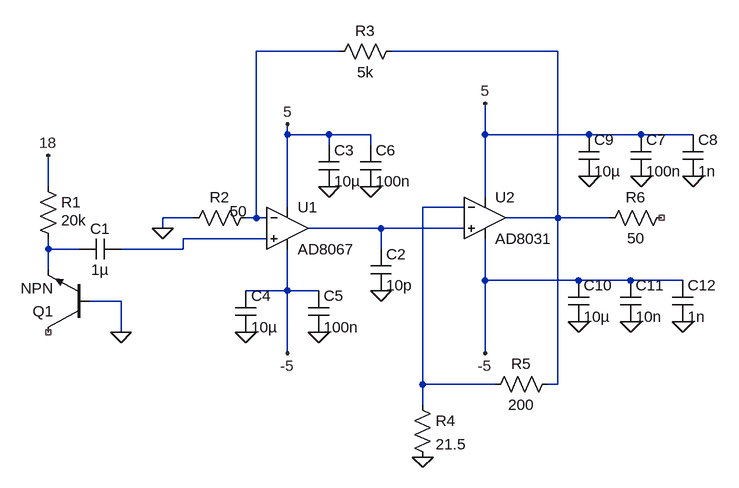
[diagram p0: schematic AD8067Test.asc]
AD8067Test.asc, the LTspice schematic file:
Version 4
SHEET 1 1224 680
WIRE 624 -176 496 -176
WIRE 960 -176 704 -176
WIRE 544 -48 544 -64
WIRE 608 -48 544 -48
WIRE 672 -48 608 -48
WIRE 848 -48 848 -96
WIRE 1008 -48 848 -48
WIRE 1088 -48 1008 -48
WIRE 1168 -48 1088 -48
WIRE 608 -32 608 -48
WIRE 672 -32 672 -48
WIRE 176 32 176 -16
WIRE 848 48 848 -48
WIRE 544 64 544 -48
WIRE 816 64 752 64
WIRE 400 80 352 80
WIRE 496 80 496 -176
WIRE 496 80 480 80
WIRE 512 80 496 80
WIRE 960 80 960 -176
WIRE 960 80 880 80
WIRE 1040 80 960 80
WIRE 352 96 352 80
WIRE 688 96 576 96
WIRE 816 96 688 96
WIRE 512 112 384 112
WIRE 176 128 176 112
WIRE 224 128 176 128
WIRE 384 128 384 112
WIRE 384 128 288 128
WIRE 688 128 688 96
WIRE 176 160 176 128
WIRE 848 176 848 112
WIRE 992 176 848 176
WIRE 1072 176 992 176
WIRE 1152 176 1072 176
WIRE 544 192 544 128
WIRE 544 192 480 192
WIRE 592 192 544 192
WIRE 288 208 240 208
WIRE 288 256 288 208
WIRE 544 288 544 192
WIRE 848 288 848 176
WIRE 752 336 752 64
WIRE 864 336 752 336
WIRE 960 336 960 80
WIRE 960 336 944 336
WIRE 752 368 752 336
FLAG 288 256 0
FLAG 176 -16 18
FLAG 544 -64 5
FLAG 848 -96 5
FLAG 544 288 -5
FLAG 848 288 -5
FLAG 352 96 0
FLAG 752 448 0
FLAG 688 192 0
FLAG 608 32 0
FLAG 672 32 0
FLAG 592 256 0
FLAG 480 256 0
FLAG 1008 16 0
FLAG 1088 16 0
FLAG 1168 16 0
FLAG 1152 240 0
FLAG 1072 240 0
FLAG 992 240 0
SYMBOL npn 240 256 R180
SYMATTR InstName Q1
SYMBOL res 160 16 R0
WINDOW 3 36 68 Left 2
SYMATTR InstName R1
SYMATTR Value 20k
SYMBOL cap 288 112 R90
WINDOW 0 0 32 VBottom 2
WINDOW 3 32 32 VTop 2
SYMATTR InstName C1
SYMATTR Value 1µ
SYMBOL Opamps\\AD8067 544 32 R0
SYMATTR InstName U1
SYMBOL Opamps\\AD8031 848 16 R0
SYMATTR InstName U2
SYMBOL res 496 64 R90
WINDOW 0 0 56 VBottom 2
WINDOW 3 -10 27 VTop 2
SYMATTR InstName R2
SYMATTR Value 50
SYMBOL res 720 -192 R90
WINDOW 0 0 56 VBottom 2
WINDOW 3 32 56 VTop 2
SYMATTR InstName R3
SYMATTR Value 5k
SYMBOL res 736 352 R0
SYMATTR InstName R4
SYMATTR Value 21.5
SYMBOL res 960 320 R90
WINDOW 0 0 56 VBottom 2
WINDOW 3 32 56 VTop 2
SYMATTR InstName R5
SYMATTR Value 200
SYMBOL res 1136 64 R90
WINDOW 0 0 56 VBottom 2
WINDOW 3 32 56 VTop 2
SYMATTR InstName R6
SYMATTR Value 50
SYMBOL cap 672 128 R0
SYMATTR InstName C2
SYMATTR Value 10p
SYMBOL cap 592 -32 R0
SYMATTR InstName C3
SYMATTR Value 10µ
SYMBOL cap 464 192 R0
SYMATTR InstName C4
SYMATTR Value 10µ
SYMBOL cap 576 192 R0
SYMATTR InstName C5
SYMATTR Value 100n
SYMBOL cap 656 -32 R0
SYMATTR InstName C6
SYMATTR Value 100n
SYMBOL cap 1072 -48 R0
SYMATTR InstName C7
SYMATTR Value 100n
SYMBOL cap 1152 -48 R0
SYMATTR InstName C8
SYMATTR Value 1n
SYMBOL cap 992 -48 R0
SYMATTR InstName C9
SYMATTR Value 10µ
SYMBOL cap 976 176 R0
SYMATTR InstName C10
SYMATTR Value 10µ
SYMBOL cap 1056 176 R0
SYMATTR InstName C11
SYMATTR Value 10n
SYMBOL cap 1136 176 R0
SYMATTR InstName C12
SYMATTR Value 1n

The netlist it stands for:
* AD8067Test.asc
Q1 NC_01 0 N006 0 NPN
R1 18 N006 20k
C1 N005 N006 1µ
XU1 N005 N001 5 -5 N004 AD8067  ; pins In+ In- V+ V- OUT
XU2 N004 N003 5 -5 N002 AD8031  ; pins In+ In- V+ V- OUT
R2 N001 0 50
R3 N002 N001 5k
R4 N003 0 21.5
R5 N002 N003 200
R6 NC_02 N002 50
C2 N004 0 10p
C3 5 0 10µ
C4 -5 0 10µ
C5 -5 0 100n
C6 5 0 100n
C7 5 0 100n
C8 5 0 1n
C9 5 0 10µ
C10 -5 0 10µ
C11 -5 0 10n
C12 -5 0 1n
.model NPN NPN
.model PNP PNP
.lib standard.bjt
.backanno
.end